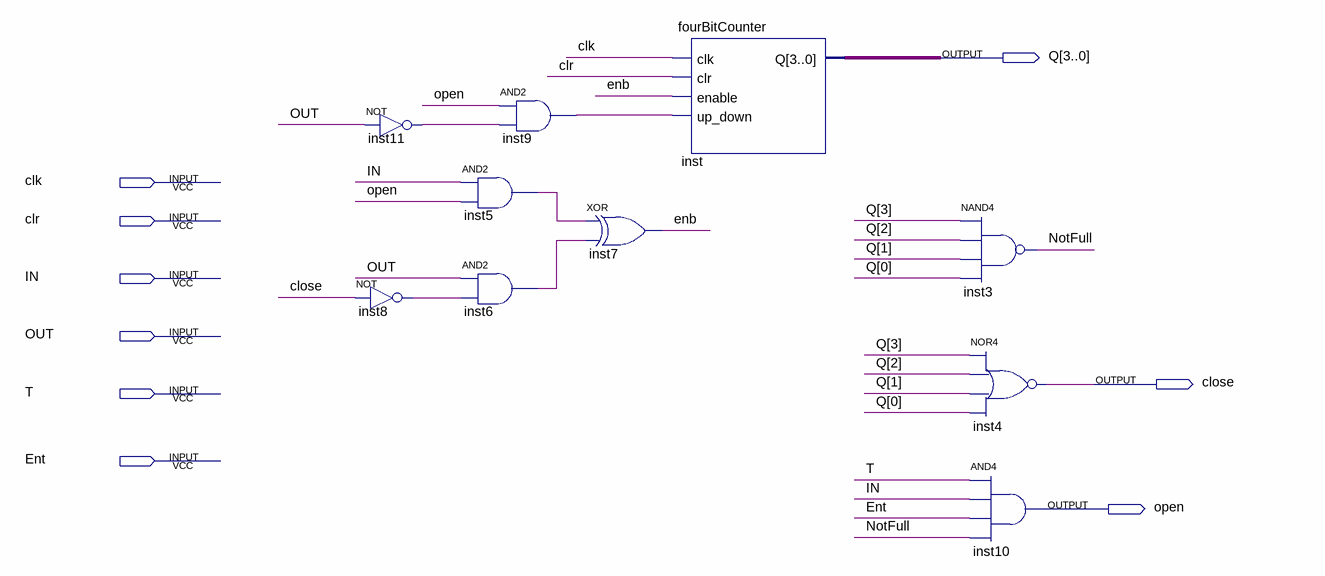
[diagram p0: schematic sheet]
// Quartus schematic WaitingRoom.bdf as structural Verilog: 10 symbols, 9 pins
module WaitingRoom (
  input  clk,
  input  clr,
  input  IN,
  input  OUT,
  input  T,
  input  Ent,
  output [3:0] Q,
  output close,
  output open
);

  wire enb, inst5_out, inst6_out, inst8_out, inst9_out, inst11_out, NotFull;

  not inst11 (inst11_out, OUT);
  not inst8 (inst8_out, close);
  and inst5 (inst5_out, IN, open);
  and inst6 (inst6_out, OUT, inst8_out);
  and inst9 (inst9_out, open, inst11_out);
  xor inst7 (enb, inst5_out, inst6_out);
  fourBitCounter inst (.clk(clk), .clr(clr), .enable(enb), .up_down(inst9_out), .Q(Q));
  nand inst3 (NotFull, Q[3], Q[2], Q[1], Q[0]);
  nor inst4 (close, Q[3], Q[2], Q[1], Q[0]);
  and inst10 (open, T, IN, Ent, NotFull);
endmodule
